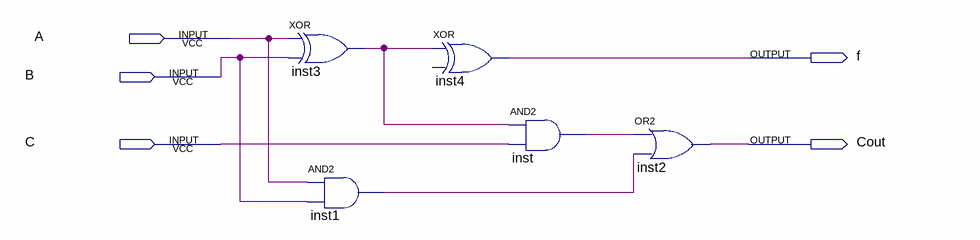
[diagram p0: schematic sheet]
// Quartus schematic suma2.bdf as structural Verilog: 5 symbols, 5 pins
module suma2 (
  input  A,
  input  B,
  input  C,
  output f,
  output Cout
);

  wire inst1_out, inst3_out, inst_out;

  xor inst3 (inst3_out, A, B);
  and inst1 (inst1_out, A, B);
  buf inst4 (f, inst3_out);  // XOR open: IN2
  and inst (inst_out, inst3_out, C);
  or inst2 (Cout, inst_out, inst1_out);
endmodule
